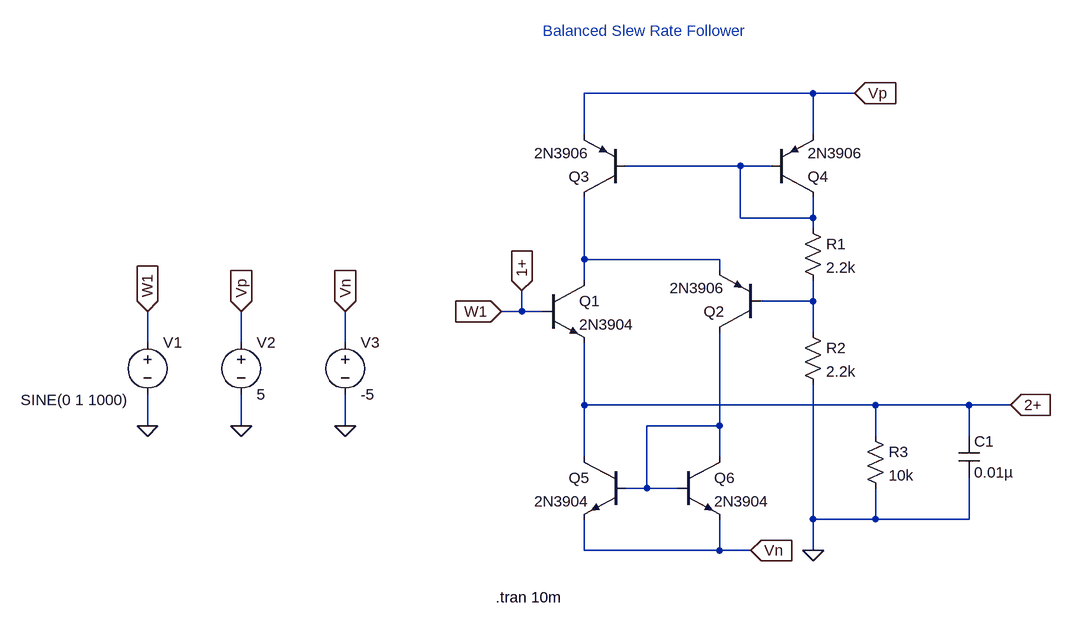
[diagram p0: schematic balanced_sr_flw_ltspice.asc]
balanced_sr_flw_ltspice.asc, the LTspice schematic file:
Version 4
SHEET 1 916 680
WIRE 432 -400 80 -400
WIRE 496 -400 432 -400
WIRE 80 -336 80 -400
WIRE 432 -336 432 -400
WIRE 320 -288 144 -288
WIRE 368 -288 320 -288
WIRE 320 -208 320 -288
WIRE 432 -208 432 -240
WIRE 432 -208 320 -208
WIRE 432 -192 432 -208
WIRE 80 -144 80 -240
WIRE 288 -144 80 -144
WIRE 288 -128 288 -144
WIRE 80 -112 80 -144
WIRE 432 -80 432 -112
WIRE 432 -80 352 -80
WIRE -16 -64 -16 -96
WIRE -16 -64 -48 -64
WIRE 16 -64 -16 -64
WIRE 432 -32 432 -80
WIRE -592 -16 -592 -64
WIRE -448 -16 -448 -64
WIRE -288 -16 -288 -64
WIRE 80 80 80 -16
WIRE 528 80 80 80
WIRE 672 80 528 80
WIRE 736 80 672 80
WIRE -592 112 -592 64
WIRE -448 112 -448 64
WIRE -288 112 -288 64
WIRE 288 112 288 -32
WIRE 288 112 176 112
WIRE 528 128 528 80
WIRE 672 128 672 80
WIRE 80 160 80 80
WIRE 288 160 288 112
WIRE 176 208 176 112
WIRE 176 208 144 208
WIRE 224 208 176 208
WIRE 432 256 432 48
WIRE 528 256 528 208
WIRE 528 256 432 256
WIRE 672 256 672 192
WIRE 672 256 528 256
WIRE 80 304 80 256
WIRE 288 304 288 256
WIRE 288 304 80 304
WIRE 336 304 288 304
WIRE 432 304 432 256
FLAG -592 112 0
FLAG -448 112 0
FLAG -288 112 0
FLAG -592 -64 W1
IOPIN -592 -64 In
FLAG -448 -64 Vp
IOPIN -448 -64 In
FLAG -288 -64 Vn
IOPIN -288 -64 In
FLAG 432 304 0
FLAG 496 -400 Vp
IOPIN 496 -400 In
FLAG 336 304 Vn
IOPIN 336 304 In
FLAG -48 -64 W1
IOPIN -48 -64 In
FLAG 736 80 2+
IOPIN 736 80 In
FLAG -16 -96 1+
IOPIN -16 -96 In
SYMBOL voltage -592 -32 R0
WINDOW 3 -195 104 Left 2
WINDOW 123 0 0 Left 0
WINDOW 39 0 0 Left 0
SYMATTR Value SINE(0 1 1000)
SYMATTR InstName V1
SYMBOL voltage -448 -32 R0
WINDOW 123 0 0 Left 0
WINDOW 39 0 0 Left 0
SYMATTR InstName V2
SYMATTR Value 5
SYMBOL voltage -288 -32 R0
WINDOW 123 0 0 Left 0
WINDOW 39 0 0 Left 0
SYMATTR InstName V3
SYMATTR Value -5
SYMBOL cap 656 128 R0
SYMATTR InstName C1
SYMATTR Value 0.01µ
SYMBOL npn 16 -112 R0
SYMATTR InstName Q1
SYMATTR Value 2N3904
SYMBOL pnp 352 -32 R180
SYMATTR InstName Q2
SYMATTR Value 2N3906
SYMBOL pnp 144 -240 R180
SYMATTR InstName Q3
SYMATTR Value 2N3906
SYMBOL pnp 368 -240 M180
SYMATTR InstName Q4
SYMATTR Value 2N3906
SYMBOL npn 144 160 M0
SYMATTR InstName Q5
SYMATTR Value 2N3904
SYMBOL npn 224 160 R0
SYMATTR InstName Q6
SYMATTR Value 2N3904
SYMBOL res 416 -208 R0
SYMATTR InstName R1
SYMATTR Value 2.2k
SYMBOL res 416 -48 R0
SYMATTR InstName R2
SYMATTR Value 2.2k
SYMBOL res 512 112 R0
SYMATTR InstName R3
SYMATTR Value 10k
TEXT -56 376 Left 2 !.tran 10m
TEXT 16 -496 Left 2 ;Balanced Slew Rate Follower

The netlist it stands for:
* balanced_sr_flw_ltspice.asc
V1 1+ 0 SINE(0 1 1000)
V2 Vp 0 5
V3 Vn 0 -5
C1 2+ 0 0.01µ
Q1 N002 1+ 2+ 0 2N3904
Q2 N004 N003 N002 0 2N3906
Q3 N002 N001 Vp 0 2N3906
Q4 N001 N001 Vp 0 2N3906
Q5 2+ N004 Vn 0 2N3904
Q6 N004 N004 Vn 0 2N3904
R1 N001 N003 2.2k
R2 N003 0 2.2k
R3 2+ 0 10k
.model NPN NPN
.model PNP PNP
.lib standard.bjt
.tran 10m
* Balanced Slew Rate Follower
.backanno
.end